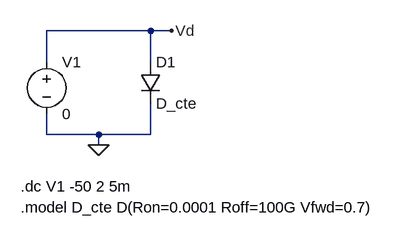
[diagram p0: schematic curva-vi_cte.asc]
curva-vi_cte.asc, the LTspice schematic file:
Version 4
SHEET 1 1024 680
WIRE 256 96 96 96
WIRE 288 96 256 96
WIRE 96 144 96 96
WIRE 256 144 256 96
WIRE 96 256 96 224
WIRE 176 256 96 256
WIRE 256 256 256 208
WIRE 256 256 176 256
WIRE 176 272 176 256
FLAG 288 96 Vd
FLAG 176 272 0
SYMBOL diode 240 144 R0
SYMATTR InstName D1
SYMATTR Value D_cte
SYMBOL voltage 96 128 R0
SYMATTR InstName V1
SYMATTR Value 0
TEXT 56 336 Left 2 !.dc V1 -50 2 5m
TEXT 56 368 Left 2 !.model D_cte D(Ron=0.0001 Roff=100G Vfwd=0.7)

The netlist it stands for:
* curva-vi_cte.asc
D1 Vd 0 D_cte
V1 Vd 0 0
.model D D
.lib standard.dio
.dc V1 -50 2 5m
.model D_cte D(Ron=0.0001 Roff=100G Vfwd=0.7)
.backanno
.end